# EAGLE design VCNL4040_IR_Finger_Sensor_Production (EAGLE 7.7.0)
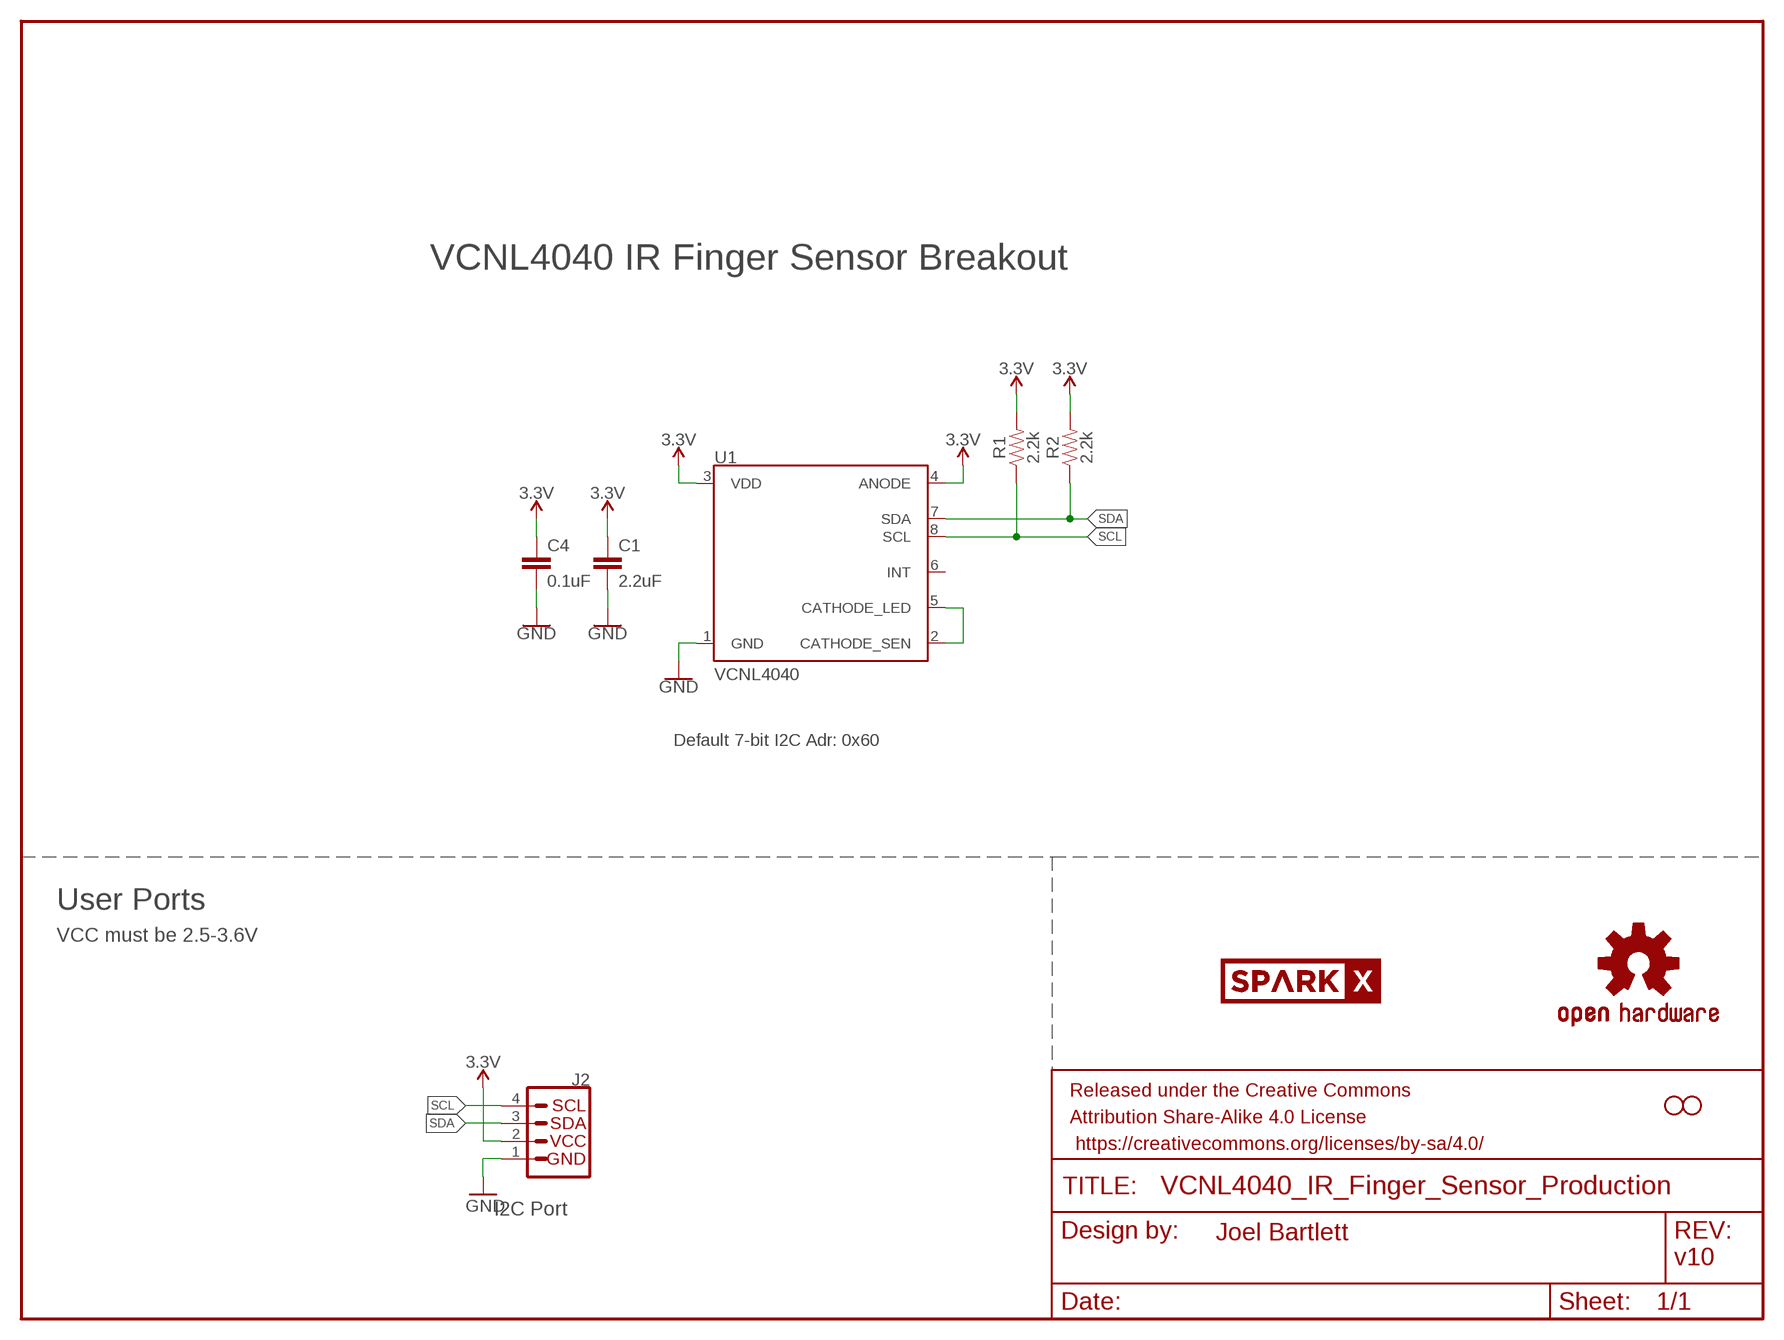
[diagram p0: schematic, sheet 1]

## Parts
C1  2.2uF  2.2UF-0603-10V-20%  [0603]
C4  0.1uF  0.1UF-0603-25V-(+80/-20%)  [0603]
FRAME2  FRAME-LETTER  [CREATIVE_COMMONS]
J2  I2C_STANDARDJS-1MM  [1X04_1MM_RA]
R1  2.2k  2.2KOHM-0603-1/10W-1%  [0603]
R2  2.2k  2.2KOHM-0603-1/10W-1%  [0603]
U1  VCNL4040  [VCNL4040]
U$1  OSHW-LOGOS  [OSHW-LOGO-S]
U$2  SPARKX-LOGO3  [SPARKX-SMALL]
U$3  STAND-OFF  [STAND-OFF-#2]
U$4  STAND-OFF  [STAND-OFF-#2]

## Nets
3.3V: C1.1 C4.1 J2.2(VCC) R1.2 R2.2 U1.3(VDD) U1.4(ANODE)
GND: C1.2 C4.2 J2.1(GND) U1.1(GND)
N$1: U1.2(CATHODE_SEN) U1.5(CATHODE_LED)
SCL: J2.4(SCL) R1.1 U1.8(SCL)
SDA: J2.3(SDA) R2.1 U1.7(SDA)
Unconnected: U1.6(INT)

## Notes on the sheet
- VCNL4040 IR Finger Sensor Breakout
- Default 7-bit I2C Adr: 0x60
- User Ports
- VCC must be 2.5-3.6V
- I2C Port
- Joel Bartlett
- v10

## Library data of the parts
C1 = SparkFun-Capacitors:2.2UF: 2.2µF ceramic capacitors A capacitor is a passive two-terminal electrical component used to store electrical energy temporarily in an electric field.; PROD_ID: CAP-07888
C4 = SparkFun-Capacitors:0.1UF: 0.1µF ceramic capacitors A capacitor is a passive two-terminal electrical component used to store electrical energy temporarily in an electric field.; PROD_ID: CAP-00810
FRAME2 = SparkFun-Aesthetics:FRAME-LETTER: Schematic Frame Standard 8.5x11 US Letter frame
J2 = SparkX:I2C_STANDARD: SparkFun I2C Standard Pinout Header SparkFun has standardized on a pinout for all I2C based sensor breakouts. This pinout allows I2C boards to be plugged directly into the headers on Arduino Uno compatible boards, and to be daisy chained easily. Example SparkFun Products: SparkFun Atmospheric Sensor Breakout - BME280 <https://www.sparkfun.com/products/13676> SparkFun Altitude/Pressure Sensor Breakout - MPL3115A2 <https://www.sparkfun.com/products/11084> SparkFun TOF Range Finder Sensor - VL6180 <https://www.sparkfun.com/products/12785>
R1 R2 = SparkFun-Resistors:2.2KOHM: 2.2kΩ resistor A resistor is a passive two-terminal electrical component that implements electrical resistance as a circuit element. Resistors act to reduce current flow, and, at the same time, act to lower voltage levels within circuits. - Wikipedia; PROD_ID: RES-08272
U1 = SparkX:VCNL4040
U$1 = SparkFun:OSHW-LOGO: Open Source Hardware Logo This logo indicates the piece of hardware it is found on incorporates a OSHW license and/or adheres to the definition of open source hardware found here: http://freedomdefined.org/OSHW
U$2 = SparkX:SPARKX-LOGO
U$3 U$4 = SparkX:STAND-OFF

## Board
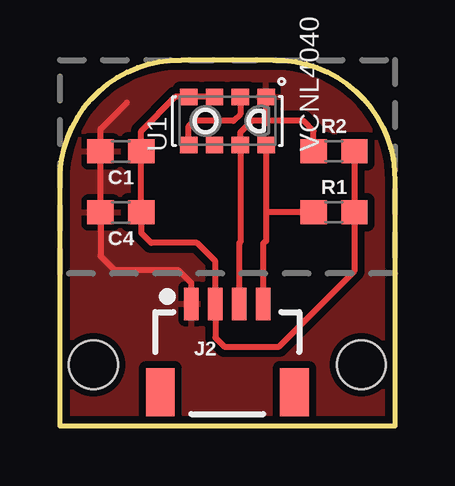
[diagram p1: board, top side]
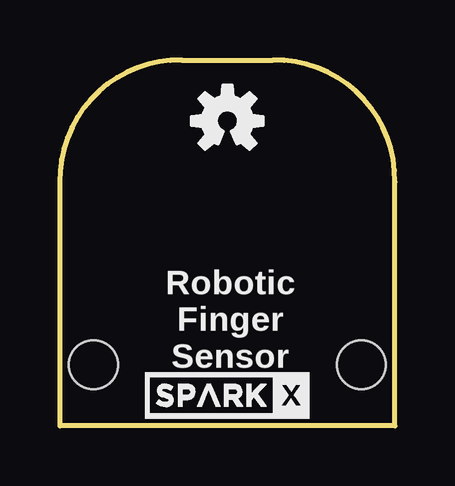
[diagram p2: board, bottom side, seen from below]

Size 13.97 x 15.24 mm. Coordinates in mm from the lower left corner, seen from the top.
Outline: 0,0 13.97,0 13.97,10.16 arc92 8.89,15.24 5.08,15.24 arc92 0,10.16 0,0
Copper layers (1*16): Top 0.035mm / dielectric 1.5mm / Bottom 0.035mm
Design rules "SparkFun-2-layer-TIGHT": minimum track width 7mil, minimum drill 15mil, track to track 7mil, track to pad 7mil, pad to pad 7mil, via to via 7mil, smd to smd 7mil, copper to edge 7mil, drill to drill 7mil, minimum pad ring 7mil, minimum via ring 7mil, stop-mask expansion 4mil, vias tented up to drill 25mil, thermal gap 10mil

### Footprints (pad centres in the part's own frame; a part is rotated, then mirrored left to right if it is on the bottom)
0603 = smd 1.1 x 1: 1 -0.85,0; 2 0.85,0
1X04_1MM_RA = smd 0.6 x 1.35: 1 -1.5,0; 2 -0.5,0; 3 0.5,0; 4 1.5,0 | smd 1.2 x 2: NC1 2.8,-3.675; NC2 -2.8,-3.675
VCNL4040 = smd 0.7 x 0.725: 1 1,-1.613; 2 1,-0.537; 3 1,0.537; 4 1,1.613; 5 -1,1.613; 6 -1,0.537; 7 -1,-0.537; 8 -1,-1.613
STAND-OFF-#2 = hole 2.032: 0,0

### Placement (x,y rotation side)
C1  2.54,11.43 180 top
C4  2.54,8.89 180 top
FRAME2  -21.59,-20.32 0 top  (outside the outline)
J2  6.99,5.08 0 top
R1  11.43,8.89 0 top
R2  11.43,11.43 0 top
U1  6.99,12.7 90 top
U$1  6.99,12.7 0 bottom
U$2  6.99,1.27 0 bottom
U$3  1.4,2.54 0 top
U$4  12.57,2.54 0 top

### Tracks (layer width: path | path; a pad name or v marks a point on that pad's centre or on a via)
3.3V
  Top 0.254: R2.2 R1.2 12.28,6.44 9.14,3.3 6.86,3.3 6.49,3.67 J2.2 6.49,6.85 5.71,7.62 3.81,7.62 3.39,8.04 C4.1 C1.1 3.39,12.28 4.81,13.7 U1.4 U1.3
GND
  Top 0.254: J2.1 5.49,5.95 4.95,6.48 2.29,6.48 1.69,7.07 C4.2 C1.2 1.69,12.36 2.79,13.46 | U1.1 8.6,12.61
  pour Top (isolate 0.305): 0,0 0,15.24 13.97,15.24 13.97,0
N$1
  Top 0.254: U1.2 7.52,12.98 7.24,12.7 5.59,12.7 5.37,12.48 U1.5
SCL
  Top 0.254: U1.8 8.6,8.89 | 8.6,8.89 8.6,7.71 8.48,7.6 J2.4 | R1.1 8.6,8.89
SDA
  Top 0.254: R2.1 10.58,12.28 10.16,12.7 8,12.7 7.52,12.22 U1.7 7.52,7.65 7.49,7.61 J2.3

### Text on the board
bPlace: Robotic / Finger / Sensor
tDocu: GooLine | N. Seidle